# EAGLE schematic ftdi2updi (EAGLE 9.6.2)
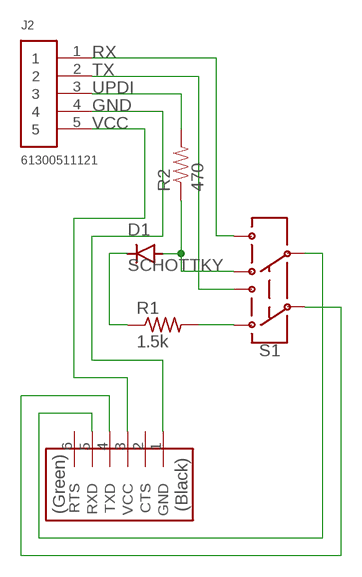
[diagram p0: schematic, sheet 1]

## Parts
D1  SCHOTTKY  DIODE_SCHOTTKY_CDBM1100-G  [MINI-SMA]
J2  61300511121  [61300511121]
R1  1.5k  R1206FAB  [R1206FAB]
R2  470  RESISTOR1206  [1206]
S1  SWITCH-DPDT-SMD-AYZ0202  [SWITCH_DPDT_SMD_AYZ0202]
U$1  CONN_06_FTDI-SMD-HEADER  [1X06SMD]

## Nets
GND: J2.4 U$1.1(GND)
N$1: S1.2 U$1.4(TXD)
N$2: S1.5 U$1.5(RXD)
N$3: D1.ANODE R2.1 S1.6
N$4: D1.KATHODE R1.1
N$11: R1.2 S1.3
RX: J2.1 S1.4
TX: J2.2 S1.1
UPDI: J2.3 R2.2
VCC: J2.5 U$1.3(VCC)
Unconnected: U$1.2(CTS) U$1.6(RTS)

## Library data of the parts
D1 = eagle_fab:DIODE_SCHOTTKY_CDBM1100-G: Diode schottky 100V 1A mini-SMA as found in the fablab inventory Reverse Voltage: 100 Volts Forward Current: 1.0 Amp Maximum forward voltage: 0.85 Volts Made by Zaerc.
J2 = Headers:61300511121: CONN HEADER VERT 5POS 2.54MM Manufacturer's datasheet <https://katalog.we-online.de/em/datasheet/6130xx11121.pdf>; CREATED_BY: PCBLayout.com; DIGI_KEY_PART_NUMBER: 732-5318-ND; MANUFACTURER: Wurth Electronics Inc.; MPN: 61300511121
R1 = eagle_fab:R: Resistor (US Symbol) Variants with postfix FAB are widened to allow the routing of internal traces
R2 = 01_SparkFun:RESISTOR: Resistor Basic schematic elements and footprints for 0603, 1206, and PTH 1/10th watt (small) resistors.
S1 = SparkFun-Switches:SWITCH-DPDT: Double-Pole, Double-Throw (DPDT) Switch Double-pole, double-throw switches. Variant Overview PTH-GPI-152-3013 Used on SparkFun Geiger Counter <https://www.sparkfun.com/products/11345> SMD-AY0202 Surface Mount DPDT Switch <https://www.sparkfun.com/products/597> (COM-00597) Used on e.g. LilyPad Arduino USB - ATmega32U4 Board <https://www.sparkfun.com/products/12049>; PROD_ID: SWCH-08179; SF_SKU: COM-00597
U$1 = fab_new:CONN_06_FTDI-SMD-HEADER

## Net classes
0 default: width 0.457 mm